# EAGLE design pwm_controller (EAGLE 7.1.0)
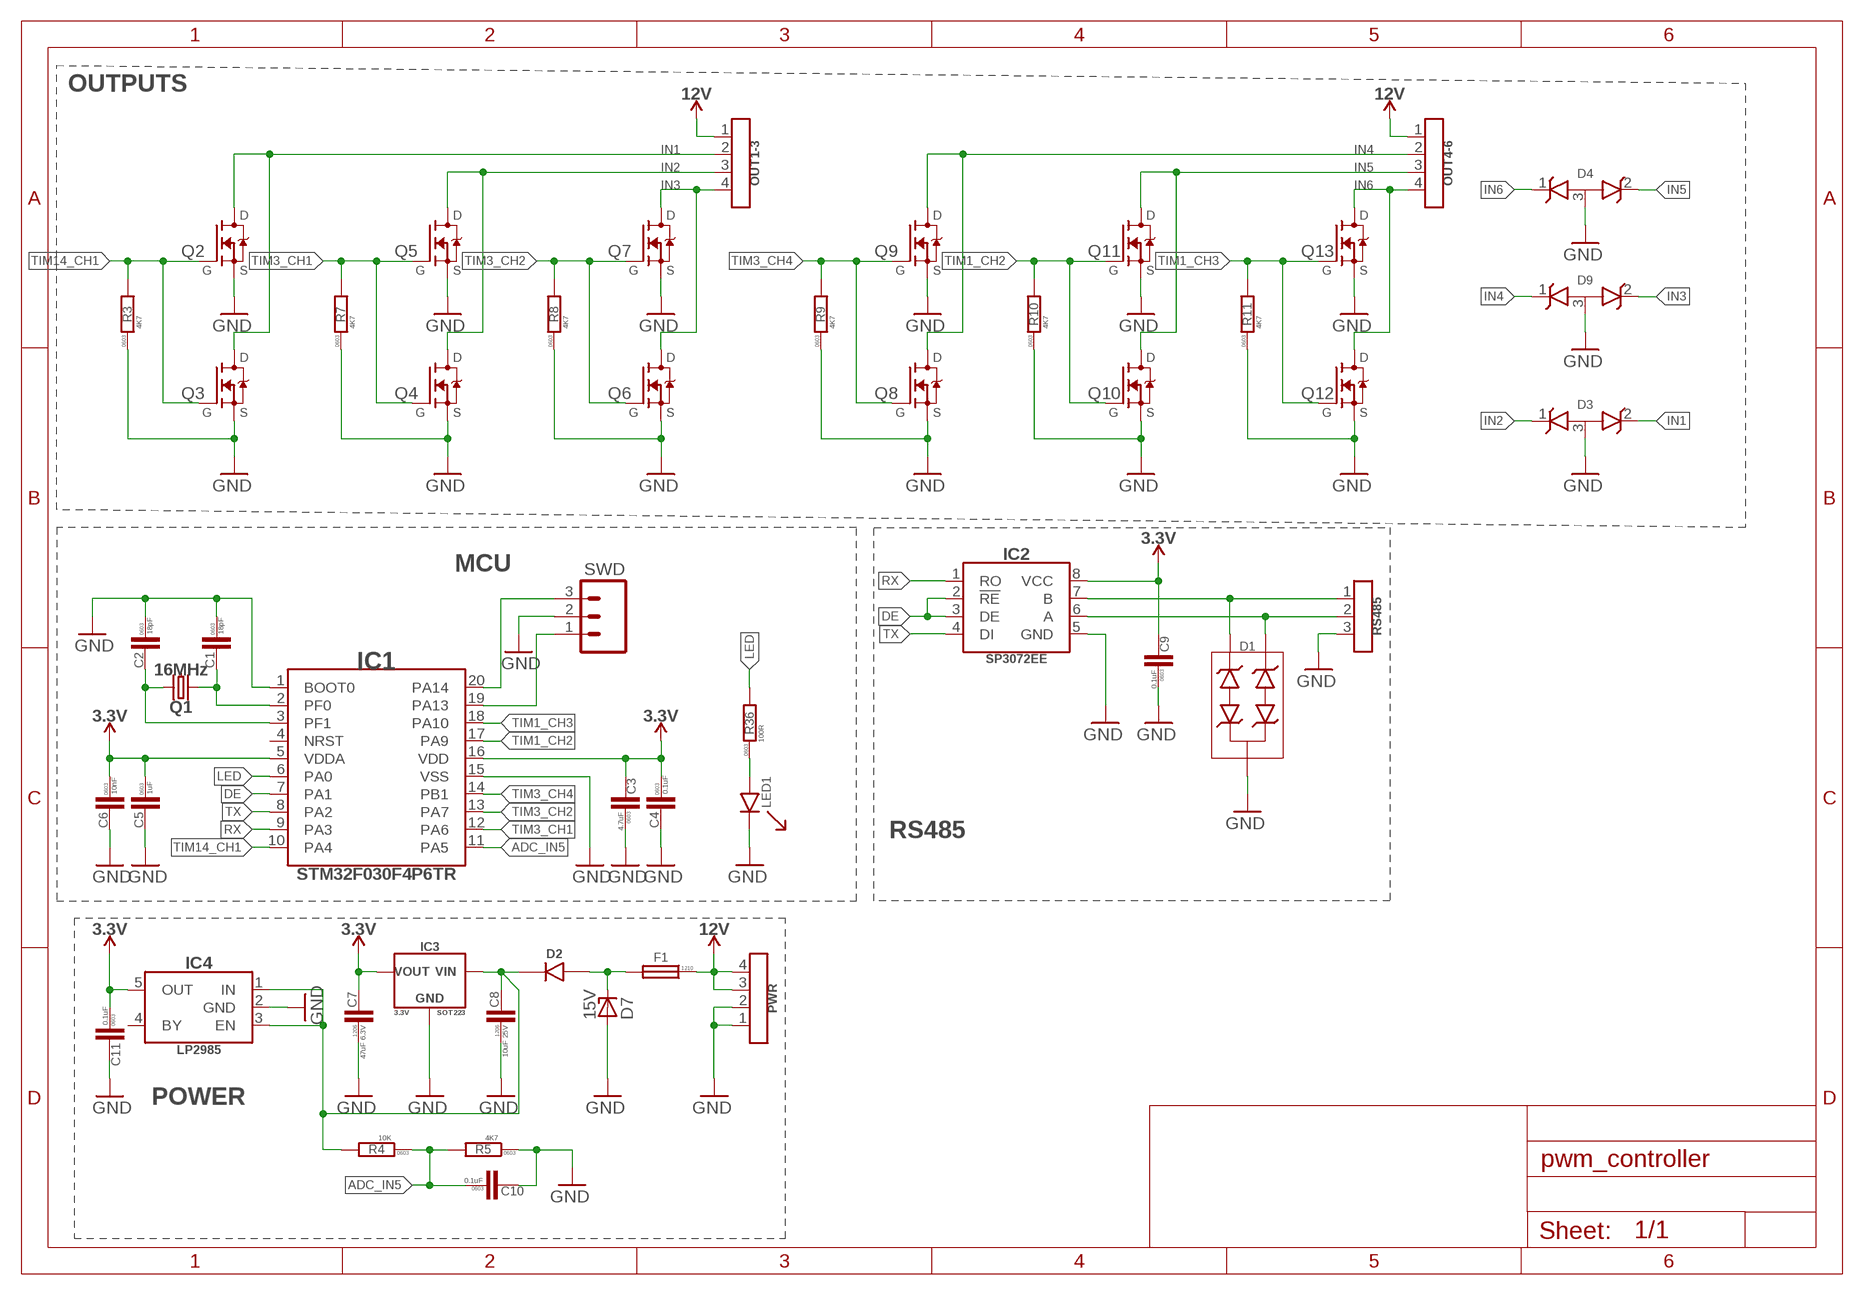
[diagram p0: schematic, sheet 1]

## Parts
C1  18pF  C-0603  [C0603]
C2  18pF  C-0603  [C0603]
C3  4.7uF  C-0603  [C0603]
C4  0.1uF  C-0603  [C0603]
C5  1uF  C-0603  [C0603]
C6  10nF  C-0603  [C0603]
C7  47uF 6.3V  C-1206  [C1206]
C8  10uF 25V  C-1206  [C1206]
C9  0.1uF  C-0603  [C0603]
C10  0.1uF  C-0603  [C0603]
C11  0.1uF  C-0603  [C0603]
D1  SM712  [SOT23B-3]
D2  MBR0520L-SOD123  [SOD123]
D3  SM12  [SOT23B-3]
D4  SM12  [SOT23B-3]
D7  15V  ZENER-DIODE  [SOT23B-3]
D9  SM12  [SOT23B-3]
F1  FUSE-1210  [F1210]
IC1  STM32F030F4P6TR  [TSSOP20]
IC2  SP3072EESOIC8  [SOIC8]
IC3  LM1117-3.3-SOT223  [SOT223@1]
IC4  3.3  LP2985  [SOT23-5L]
LED1  LED-0603  [0603_LED]
OUT1-3  CON_4P-3.81  [3.81_RECEPTABLE_ANGLE_4P]
OUT4-6  CON_4P-3.81  [3.81_RECEPTABLE_ANGLE_4P]
PWR  CON_4P-3.81  [3.81_RECEPTABLE_ANGLE_4P]
Q1  16MHz  CRYSTAL-3.2X2.5-4P  [OSCILLATOR-3.2X2.5]
Q2  IRLML2502-SOT23  [SOT23B-3]
Q3  STN3NF06L  [SOT223@1]
Q4  STN3NF06L  [SOT223@1]
Q5  IRLML2502-SOT23  [SOT23B-3]
Q6  STN3NF06L  [SOT223@1]
Q7  IRLML2502-SOT23  [SOT23B-3]
Q8  STN3NF06L  [SOT223@1]
Q9  IRLML2502-SOT23  [SOT23B-3]
Q10  STN3NF06L  [SOT223@1]
Q11  IRLML2502-SOT23  [SOT23B-3]
Q12  STN3NF06L  [SOT223@1]
Q13  IRLML2502-SOT23  [SOT23B-3]
R3  4K7  R-0603  [R0603]
R4  10K  R-0603  [R0603]
R5  4K7  R-0603  [R0603]
R7  4K7  R-0603  [R0603]
R8  4K7  R-0603  [R0603]
R9  4K7  R-0603  [R0603]
R10  4K7  R-0603  [R0603]
R11  4K7  R-0603  [R0603]
R36  100R  R-0603  [R0603]
RS485  CON_3P-3.81  [3.81_RECEPTABLE_ANGLE_3P]
SWD  M03PTH  [1X03]

## Nets
A: D1.1(C3) IC2.6(A) RS485.2
ADC_IN5: C10.1 IC1.11(PA5) R4.1 R5.2
B: D1.2(C2) IC2.7(B) RS485.1
DE: IC1.7(PA1) IC2.2(!RE) IC2.3(DE)
GND: C1.1 C2.1 C3.1 C4.2 C5.2 C6.2 C7.P$1 C8.P$1 C9.1 C10.2 C11.2 D1.3 D3.3(A) D4.3(A) D7.1(A) D9.3(A) IC1.1(BOOT0) IC1.15(VSS) IC2.5(GND) IC3.1(GND) IC4.2(GND) LED1.C PWR.1 PWR.2 Q2.2(S) Q3.3(S) Q4.3(S) Q5.2(S) Q6.3(S) Q7.2(S) Q8.3(S) Q9.2(S) Q10.3(S) Q11.2(S) Q12.3(S) Q13.2(S) R3.1 R5.1 R7.1 R8.1 R9.1 R10.1 R11.1 RS485.3 SWD.2
IN1: D3.2(C2) OUT1-3.2 Q2.3(D) Q3.2(D) Q3.4(D)
IN2: D3.1(C1) OUT1-3.3 Q4.2(D) Q4.4(D) Q5.3(D)
IN3: D9.2(C2) OUT1-3.4 Q6.2(D) Q6.4(D) Q7.3(D)
IN4: D9.1(C1) OUT4-6.2 Q8.2(D) Q8.4(D) Q9.3(D)
IN5: D4.2(C2) OUT4-6.3 Q10.2(D) Q10.4(D) Q11.3(D)
IN6: D4.1(C1) OUT4-6.4 Q12.2(D) Q12.4(D) Q13.3(D)
LED: IC1.6(PA0) R36.2
N$2: C1.2 IC1.2(PF0) Q1.1
N$7: C8.P$2 D2.C IC3.3(VIN) IC4.1(IN) IC4.3(EN) R4.2
N$8: D2.A D7.3(C) F1.2
N$12: C2.2 IC1.3(PF1) Q1.3
N$13: IC1.20(PA14) SWD.3
N$14: IC1.19(PA13) SWD.1
N$36: LED1.A R36.1
RX: IC1.9(PA3) IC2.1(RO)
TIM1_CH2: IC1.17(PA9) Q10.1(G) Q11.1(G) R10.2
TIM1_CH3: IC1.18(PA10) Q12.1(G) Q13.1(G) R11.2
TIM3_CH1: IC1.12(PA6) Q4.1(G) Q5.1(G) R7.2
TIM3_CH2: IC1.13(PA7) Q6.1(G) Q7.1(G) R8.2
TIM3_CH4: IC1.14(PB1) Q8.1(G) Q9.1(G) R9.2
TIM14_CH1: IC1.10(PA4) Q2.1(G) Q3.1(G) R3.2
TX: IC1.8(PA2) IC2.4(DI)
VDD_3V3: C3.2 C4.1 C5.1 C6.1 C7.P$2 C9.2 C11.1 IC1.5(VDDA) IC1.16(VDD) IC2.8(VCC) IC3.2(VOUT) IC3.4(VOUT) IC4.5(OUT) ; supply symbol labelled 3.3V
VDD_12V: F1.1 OUT1-3.1 OUT4-6.1 PWR.3 PWR.4 ; supply symbol labelled 12V
Unconnected: IC1.4(NRST) IC4.4(BY) Q1.2(GND) Q1.4(GND)

## Notes on the sheet
- OUTPUTS
- MCU
- RS485
- POWER

## Library data of the parts
C1-C6 C9-C11 = rc:C; PACKAGE: 0603
C7 C8 = rc:C; PACKAGE: 1206
D1 = esp8266_master_lib:SM712: TVS DIODE 12VWM/7VWM SOT23; DIGIKEY#: SM712-TPMSCT-ND; MANF: Semtech Corporation; MANF#: SM712.TCT
D2 = led_matrix_master_lib:MBR0520L: DIODE SCHOTTKY 20V 500MA SOD123; DIGIKEY#: MBR0520LT1GOSTR-ND; MANF: ON Semiconductor; MANF#: MBR0520LT1G
D3 D4 D9 = Geopath_master_library:SM12: TVS DIODE 12VWM 19VC SOT23; DIGIKEY#: SM12TR-ND; MANF: Semtech Corporation; MANF#: SM12.TCT
D7 = watchdog_master_library:ZENER-DIODE: Z-Diode; DIGIKEY#: BZX84C15LT1GOSTR-ND; MANF: ON Semiconductor; MANF#: BZX84C15LT1G
F1 = usb2can_master_lib:FUSE; DIGIKEY#: 507-1786-1-ND; LINK: http://www.chipdip.ru/product/mf-msmf050/; MANF: Bel Fuse Inc; MANF#: 0ZCH0050FF2G; PACKAGE: 1210
IC1 = watchdog_master_library:STM32F030F4P6TR: IC MCU 32BIT 16KB FLASH 20TSSOP; DIGIKEY#: STM32F030F4P6TR-ND; MANF: STMicroelectronics; MANF#: STM32F030F4P6TR; TEMPERATURE: -40°C ~ 85°C
IC2 = watchdog_master_library:SP3072EE; DIGIKEY#: 1016-1784-1-ND; MANF: Exar Corporation; MANF#: SP3072EEN-L/TR
IC3 = watchdog_master_library:LM1117-3.3: IC REG LDO 3.3V 0.8A SOT223; DIGIKEY#: LM1117MPX-3.3/NOPBDKR-ND; MANF: Texas Instruments; MANF#: LM1117MPX-3.3/NOPB; PACKAGE: SOT223; VOLTAGE: 3.3V
IC4 = watchdog_master_library:LP2985
LED1 = led_matrix_master_lib:LED; COLOR: RED
OUT1-3 OUT4-6 PWR = degson_con:CON_4P; MANF: DEGSON; MANF#: 15EDGRC-3.81-4P-14
Q1 = watchdog_master_library:CRYSTAL: Smd Crystal; DIGIKEY#: 1253-1182-1-ND; MANF: AVX Corp/Kyocera Corp; MANF#: CX3225GB16000P0HPQCC
Q2 Q5 Q7 Q9 Q11 Q13 = watchdog_master_library:IRLML2502: MOSFET N-CH 20V 4.2A SOT-23; DIGIKEY#: IRLML2502PBFTR-ND; MANF: Infineon Technologies; MANF#: IRLML2502TRPBF
Q3 Q4 Q6 Q8 Q10 Q12 = watchdog_master_library:STN3NF06L; DIGIKEY#: 497-3177-1-ND; MANF: STMicroelectronics; MANF#: STN3NF06L
R3-R5 R7-R11 R36 = rc:R; PACKAGE: 0603
RS485 = degson_con:CON_3P; MANF: DEGSON; MANF#: 15EDGRC-3.81-3P-14
SWD = watchdog_master_library:M03: Header 3 Standard 3-pin 0.1" header. Use with straight break away headers (SKU : PRT-00116), right angle break away headers (PRT-00553), swiss pins (PRT-00743), machine pins (PRT-00117), and female headers (PRT-00115). Molex polarized connector foot print use with SKU : PRT-08232 with associated crimp pins and housings.

## Board
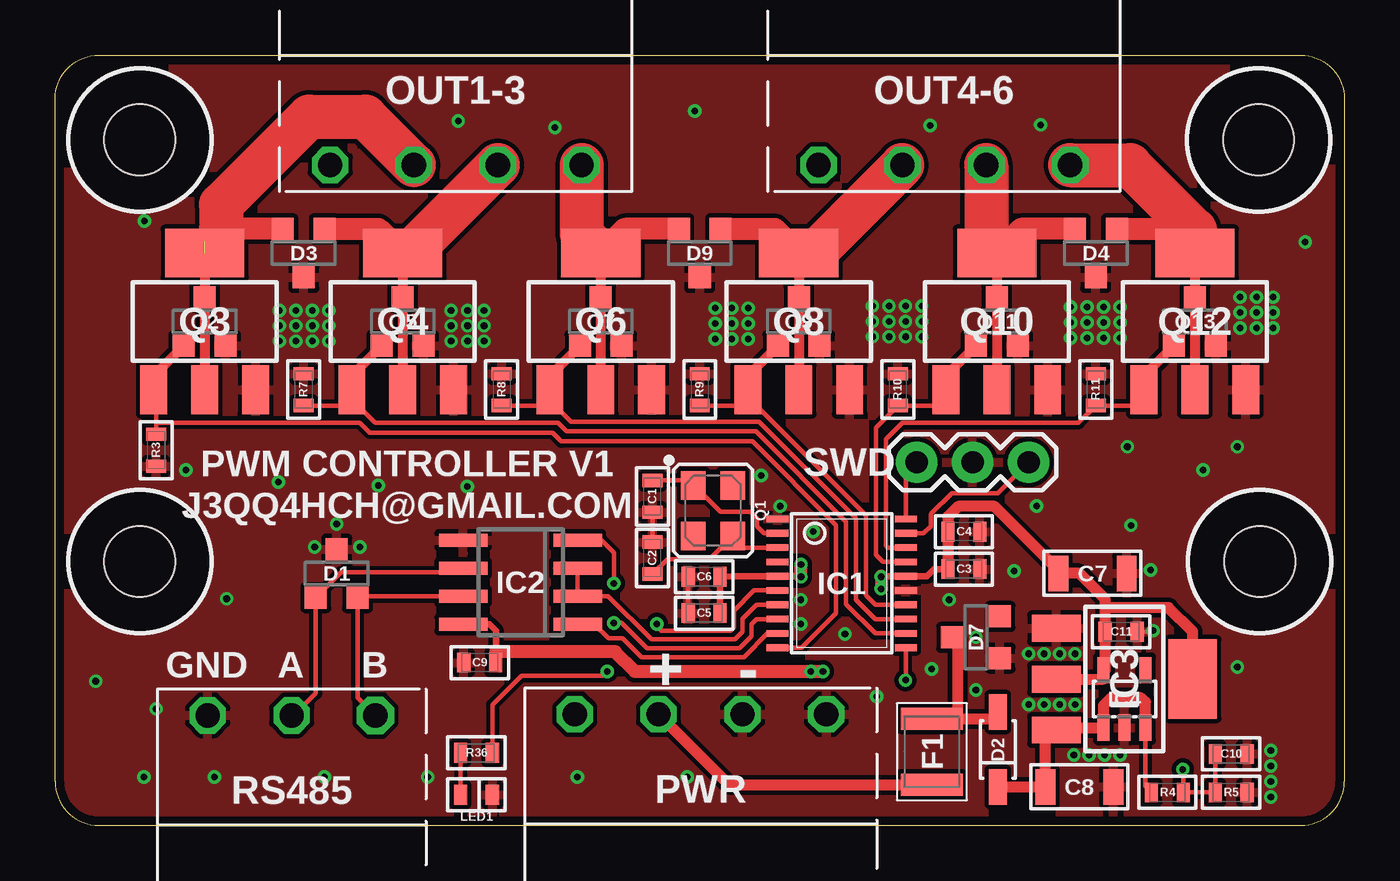
[diagram p1: board, top side]
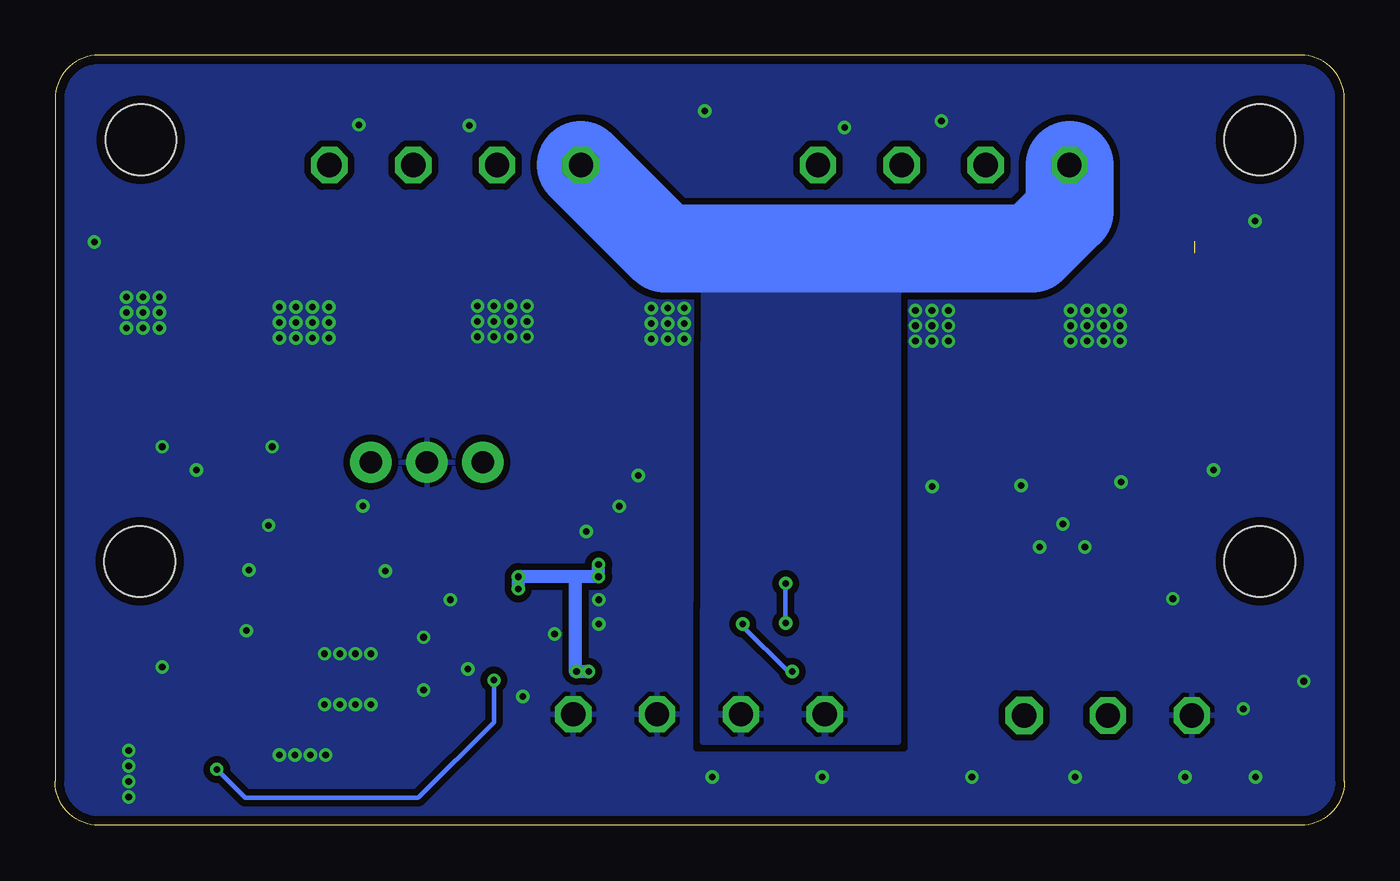
[diagram p2: board, bottom side, seen from below]

Size 58.6 x 35 mm. Coordinates in mm from the lower left corner, seen from the top.
Copper layers (1*16): Top 0.035mm / dielectric 0.5mm / Bottom 0.035mm
Design rules "design_rules *": minimum track width 0.2mm, minimum drill 0.2mm, track to track 0.2mm, track to pad 0.2mm, pad to pad 0.2mm, via to via 0.2mm, smd to smd 0.15mm, copper to edge 0.4mm, drill to drill 0.2mm, minimum pad ring 0.125mm, minimum via ring 6mil, stop-mask expansion 1mil, vias tented up to drill 0.31mm, thermal gap 8mil
Holes 3.2 mm at 3.85,31.15 54.7,31.15 54.75,12 3.85,12
tRestrict: area 51.5,8.8 to 58,15.2; area 0.6,27.9 to 7.1,34.4; area 51.5,27.9 to 58,34.4; area 0.6,8.8 to 7.1,15.2

### Footprints (pad centres in the part's own frame; a part is rotated, then mirrored left to right if it is on the bottom)
C0603 = smd 0.6 x 0.9: 1 -0.725,0; 2 0.725,0
C1206 = smd 0.9 x 1.6: P$1 -1.55,0; P$2 1.55,0
SOT23B-3 = smd 1 x 1: 1 -0.95,-1.1; 2 0.95,-1.1; 3 0,1.1
SOD123 = smd 1.6 x 0.8: A 1.7,0; C -1.7,0
F1210 = smd 1 x 2.8: 1 -1.5,0; 2 1.5,0
TSSOP20 = smd 0.305 x 0.991: 1 -2.925,-2.918; 2 -2.275,-2.918; 3 -1.625,-2.918; 4 -0.975,-2.918; 5 -0.325,-2.918; 6 0.325,-2.918; 7 0.975,-2.918; 8 1.625,-2.918; 9 2.275,-2.918; 10 2.925,-2.918; 11 2.925,2.918; 12 2.275,2.918; 13 1.625,2.918; 14 0.975,2.918; 15 0.325,2.918; 16 -0.325,2.918; 17 -0.975,2.918; 18 -1.625,2.918; 19 -2.275,2.918; 20 -2.925,2.918
SOIC8 = smd 2.2 x 0.6: 1 -2.6,1.905; 2 -2.6,0.635; 3 -2.6,-0.635; 4 -2.6,-1.905; 5 2.6,-1.905; 6 2.6,-0.635; 7 2.6,0.635; 8 2.6,1.905
SOT223@1 = smd 1.219 x 2.235: 1 -2.311,-3.099; 2 0,-3.099; 3 2.311,-3.099 | smd 3.6 x 2.2: 4 0,3.099
SOT23-5L = smd 0.55 x 1.2: 1 -0.95,-1.3; 2 0,-1.3; 3 0.95,-1.3; 4 0.95,1.3; 5 -0.95,1.3
0603_LED = smd 0.6 x 0.9: A 0.725,0; C -0.725,0
3.81_RECEPTABLE_ANGLE_4P = drill 1.1 octagon: 1 -5.7,-3.4; 2 -1.89,-3.4; 3 1.92,-3.4; 4 5.73,-3.4
OSCILLATOR-3.2X2.5 = smd 1.3 x 1.1: 1 -1.15,-0.9; 2 1.15,-0.9; 3 1.15,0.9; 4 -1.15,0.9
R0603 = smd 0.6 x 0.9: 1 -0.725,0; 2 0.725,0
3.81_RECEPTABLE_ANGLE_3P = drill 1.1 pad 1.7 octagon: 1 -3.81,-3.4 | drill 1.1 octagon: 2 0,-3.4; 3 3.81,-3.4
1X03 = drill 1.016 pad 1.88: 1 -2.54,0; 2 0,0; 3 2.54,0

### Placement (x,y rotation side)
C1  27.15,14.95 90 top
C2  27.15,12.15 270 top
C3  41.3,11.65 180 top
C4  41.3,13.35 0 top
C5  29.5,9.65 180 top
C6  29.5,11.3 180 top
C7  47.15,11.45 180 top
C8  46.55,1.75 180 top
C9  19.3,7.4 0 top
C10  53.45,3.25 0 top
C11  48.45,8.8 0 top
D1  12.8,11.45 0 top
D2  42.85,3.45 90 top
D3  11.3,26 180 top
D4  47.3,26 180 top
D7  41.85,8.55 90 top
D9  29.3,26 180 top
F1  39.85,3.35 90 top
IC1  35.75,11 270 top
IC2  21.15,11.05 180 top
IC3  48.6,6.65 270 top
IC4  48.6,5.75 0 top
LED1  19.15,1.4 180 top
OUT1-3  18.2,33.4 0 top
OUT4-6  40.4,33.4 0 top
PWR  29.35,1.65 180 top
Q1  29.9,14.3 270 top
Q2  6.8,22.9 0 top
Q3  6.8,22.9 0 top
Q4  15.8,22.9 0 top
Q5  15.8,22.9 0 top
Q6  24.8,22.9 0 top
Q7  24.8,22.9 0 top
Q8  33.8,22.9 0 top
Q9  33.8,22.9 0 top
Q10  42.8,22.9 0 top
Q11  42.8,22.9 0 top
Q12  51.8,22.9 0 top
Q13  51.8,22.9 0 top
R3  4.6,17.05 90 top
R4  50.55,1.5 180 top
R5  53.45,1.5 180 top
R7  11.3,19.8 270 top
R8  20.3,19.8 270 top
R9  29.3,19.8 270 top
R10  38.3,19.8 270 top
R11  47.3,19.8 270 top
R36  19.15,3.3 0 top
RS485  10.75,1.6 180 top
SWD  41.7,16.5 180 top
U$1  [BOARD_OUTLINE_V4]  0,0 0 top

### Tracks (layer width: path | path; a pad name or v marks a point on that pad's centre or on a via)
A
  Top 0.2: RS485.2 10.85,5 11.85,6 D1.1 13,11.5 18.36,11.5 IC2.6
ADC_IN5  (via drill 0.3)
  Top 0.2: C10.1 R5.2 R4.1 51.27,2.52 v51.25,2.55 | v38.65,6.6 38.67,6.62 IC1.11
  Bottom 0.2: v51.25,2.55 49.95,1.25 42.1,1.25 38.65,4.7 v38.65,6.6
B
  Top 0.2: RS485.1 13.75,5.81 D1.2 13.81,10.41 IC2.7
DE
  Top 0.2: 32.81,10 IC1.7 31.88,10.03 31.25,9.4 31.25,8.8 30.9,8.45 27.1,8.45 25.14,10.41 IC2.2 IC2.3 22.73,11.69
GND  (via drill 0.3)
  Top 0.2: C1.1 C2.1 27.12,12.85 | C6.2 C5.2 | C11.2 49.9,8.8 v49.9,8.85
  Top 0.45: 36.11,20.44 Q8.3 | 45.11,20.44 Q10.3 | 54.11,20.44 Q12.3
  other vias: 32.95,14.5 34.45,13.35 35.9,8.7 41.85,6.15 44.25,7.8 41.85,8.55 46.35,7.8 45.65,7.8 44.95,7.8 46.3,3.2 48.4,3.2 47.7,3.2 47,3.2 44.25,5.5 46.35,5.5 45.65,5.5 44.95,5.5 55.25,1.3 55.25,3.4 55.25,2.7 55.25,2 10.2,23.4 10.95,23.4 11.7,23.4 12.45,23.4 10.2,22.7 10.95,22.7 11.7,22.7 12.45,22.7 10.2,22 10.95,22 11.7,22 12.45,22 18,23.4 18.75,23.4 19.5,23.4 18,22.7 18.75,22.7 19.5,22.7 18,22 18.75,22 19.5,22 30,23.5 30.75,23.5 31.5,23.5 30,22.8 30.75,22.8 31.5,22.8 30,22.1 30.75,22.1 31.5,22.1 37.15,23.6 37.9,23.6 38.65,23.6 39.4,23.6 37.15,22.9 37.9,22.9 38.65,22.9 39.4,22.9 37.15,22.2 37.9,22.2 38.65,22.2 39.4,22.2 46.15,23.55 46.9,23.55 47.65,23.55 48.4,23.55 46.15,22.85 46.9,22.85 47.65,22.85 48.4,22.85 46.15,22.15 46.9,22.15 47.65,22.15 48.4,22.15 53.85,24 54.6,24 55.35,24 53.85,23.3 54.6,23.3 55.35,23.3 53.85,22.6 54.6,22.6 55.35,22.6 5.95,16.15 12.8,13.7 11.8,12.65 13.85,12.65 10.15,15.6 14.7,15.45 1.85,6.55 7.8,10.3 4.6,5.3 4.04,2.21 7.25,2.21 12.24,2.21 16.93,2.21 23.73,2.21 28.73,2.21 53.73,7.21 52.18,16.16 53.73,17.2 48.73,17.2 48.9,13.63 44.62,14.51 56.81,26.51 44.78,31.83 39.77,31.8 29.07,32.45 22.72,31.7 18.32,32.01 4.07,27.45 18.74,15.4 32.09,15.9 33.89,9.15 33.89,10.26 37.34,5.86 39.84,7.11 40.64,10.26 43.59,11.55 49.79,11.61
  pour Bottom (isolate 0.3, rank 3): 0,35 58.6,35 58.6,0 0,0
  pour Top: 0,35 58.6,35 58.6,0 0,0
IN1  (1 unrouted)
  Top 0.45: Q3.4 Q2.3 Q3.2
  Top 1: D3.2 7.55,27.1 7.35,27.1 6.8,26.55
  Top 2: 7.55,27.1 7.55,28.2 11.55,32.2 14.1,32.2 OUT1-3.2
IN2
  Top 0.45: Q4.4 Q5.3 Q4.2
  Top 1: D3.1 14.7,27.1 Q4.4
  Top 2: OUT1-3.3 16.12,26 Q4.4
IN3
  Top 0.45: Q6.4 Q7.3 Q6.2
  Top 1: D9.2 25.9,27.1 Q6.4
  Top 2: OUT1-3.4 23.93,26.87 Q6.4
IN4
  Top 0.45: Q8.4 Q9.3 Q8.2
  Top 1: D9.1 32.7,27.1 Q8.4
  Top 2: OUT4-6.2 34.51,26 Q8.4
IN5
  Top 0.45: Q10.4 Q11.3 Q10.2
  Top 1: D4.2 43.9,27.1 Q10.4
  Top 2: OUT4-6.3 42.32,26.48 Q10.4
IN6
  Top 0.45: Q12.4 Q13.3 Q12.2
  Top 1: D4.1 50.7,27.1 Q12.4
  Top 2: OUT4-6.4 48.85,30 51.8,27.05 Q12.4
LED  (via drill 0.3)
  Top 0.2: IC1.6 31.77,10.68 30.85,9.75 30.85,9 30.7,8.85 27.55,8.85 v27.35,9.15 | v25.1,7 24.9,6.8 21.2,6.8 19.88,5.47 R36.2
  Bottom 0.2: v25.1,7 25.3,7 27.35,9.05 v27.35,9.15
N$2
  Top 0.2: IC1.2 32.23,13.28 31.9,13.6 31.9,13.95 31.6,14.25 30.25,14.25 29.05,15.45 Q1.1 28.77,15.68 C1.2
N$7
  Top 0.2: IC4.3 49.55,1.77 R4.2
  Top 0.5: D2.C C8.P$2 45,4.34 IC3.3 45.5,4.45 IC4.1 47.65,5.45 48,5.8 49.35,5.8 49.55,5.6 IC4.3
N$8
  Top 0.5: F1.2 41,4.85 | 41,4.85 42.85,4.85 D2.A | D7.3 41,8.55 41,4.85
N$12
  Top 0.2: IC1.3 31.32,12.62 Q1.3 29.75,12.1 27.82,12.1 C2.2
N$13
  Top 0.2: IC1.20 38.67,16.01 SWD.3
N$14
  Top 0.2: IC1.19 39.48,13.28 39.8,13.6 39.8,14.15 40.75,15.1 42.84,15.1 SWD.1
N$36
  Top 0.2: R36.1 LED1.A
RX
  Top 0.2: IC2.1 24.5,9.14 25.15,8.5 25.8,8.5 26.65,7.65 31.3,7.65 32.38,8.72 IC1.9
TIM1_CH2
  Top 0.2: Q10.1 40.49,19.07 R10.2 37.3,18.07 37.3,12.3 37.62,11.97 IC1.17
  Top 0.45: Q11.1 40.49,20.44 Q10.1
TIM1_CH3
  Top 0.2: Q12.1 49.49,19.07 R11.2 46.51,18.29 46.5,18.3 38.5,18.3 37.75,17.55 37.75,12.7 37.83,12.62 IC1.18
  Top 0.45: Q13.1 49.49,20.44 Q12.1
TIM3_CH1
  Top 0.2: IC1.12 37.27,8.72 35.95,10.05 35.95,13.8 31.85,17.9 23.25,17.9 22.85,18.3 14.55,18.3 14.05,18.8 13.76,18.8 13.49,19.07 | R7.2 13.49,19.07 | 13.49,19.07 Q4.1
  Top 0.45: Q5.1 13.49,20.44 Q4.1
TIM3_CH2
  Top 0.2: IC1.13 37.27,9.38 36.4,10.25 36.4,13.95 32,18.35 23.45,18.35 22.49,19.31 | 22.49,19.07 22.45,19.07 | 22.45,19.07 R8.2 | 22.49,19.31 Q6.1 | 22.49,19.31 22.45,19.27 22.45,19.07
  Top 0.45: Q7.1 22.49,20.44 Q6.1
TIM3_CH4
  Top 0.2: IC1.14 37.27,10.03 36.85,10.45 36.85,14.1 31.49,19.46 Q8.1 31.49,19.07 R9.2
  Top 0.45: Q9.1 31.49,20.44 Q8.1
TIM14_CH1
  Top 0.2: IC1.10 33.92,8.07 35.5,9.65 35.5,13.65 31.7,17.45 23,17.45 22.6,17.85 14.3,17.85 13.85,18.3 4.6,18.3 | Q3.1 4.49,19.21 4.6,19.1 4.6,18.3 | 4.88,17.77 R3.2 4.6,18.3
  Top 0.45: Q2.1 4.49,20.44 Q3.1
TX  (via drill 0.3)
  Top 0.2: IC1.8 31.88,9.38 31.65,9.15 31.65,8.6 31.1,8.05 26.9,8.05 25.75,9.2 v25.4,9.2 | v25.4,11 25.4,12.4 24.84,12.96 IC2.4
  Bottom 0.2: v25.4,9.2 v25.4,11
VDD_3V3  (via drill 0.3)
  Top 0.3: C3.2 39.95,11.65 39.62,11.32 IC1.16 37.55,11.32 | C5.1 C6.1 30.9,11.32 IC1.5 33.9,11.32 v33.9,11.3 | IC2.8 19.75,9.14 20.05,8.85 20.05,7.92 20.02,7.9
  Top 0.5: IC3.2 47.65,6.65 IC4.5 47.73,7.05 C11.1 47.73,9.9 | IC3.4 51.7,8.8 50.6,9.9 47.73,9.9 | 47.73,9.9 47.73,10.28 46.55,11.45 C7.P$2 45.6,11.6 42.7,14.5 41.05,14.5 40.58,14.03 C4.1 C3.2
  Top 0.6: 37.55,11.32 v37.55,10.75 | v33.9,11.3 v33.9,11.85 | v34.9,7 v34.35,7 26.35,7 25.45,7.9 20.02,7.9 C9.2
  Bottom 0.6: v33.9,11.85 v33.9,11.3 34.95,11.3 | v37.55,10.75 v37.55,11.3 34.95,11.3 | 34.95,11.3 34.95,7 v34.35,7
VDD_12V
  Top 0.5: PWR.3 30.63,1.85 F1.1
  Bottom 0.2: 27.43,26.18 27.45,26.2
  Bottom 4: OUT1-3.1 12.5,27.9 14.2,26.2 27.45,26.2 30.9,26.2 OUT4-6.1
  pour Bottom (isolate 0.3): 29.15,3.8 20.3,3.8 20.3,28.05 29.1,28.05

### Text on the board
tPlace: PWM CONTROLLER V1 | J3QQ4HCH@GMAIL.COM | GND | A | B | + | -
bStop: + | CH1 | CH2 | CH3 | + | CH4 | CH5 | CH6